# Altium schematic sheet LCD_screen.SchDoc
size A; SheetNumber: 9; SheetTotal: 10
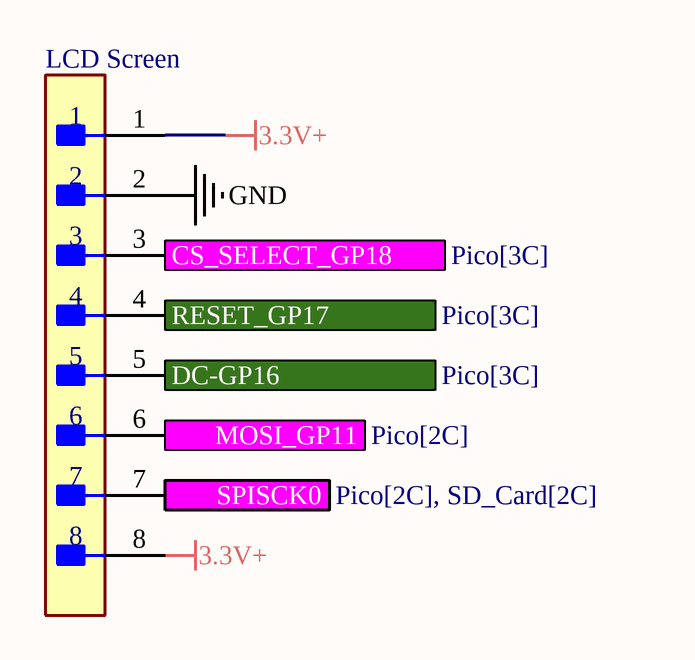
[diagram p0: LCD_screen.SchDoc]

## Parts
LCD_Screen  LCD  [FP-TSW-108-08-G-S-MFG]  (value not drawn)

## Ports
CS_SELECT_GP18 (in, see Pico[3C]), DC-GP16 (in, see Pico[3C]), MOSI_GP11 (in, see Pico[2C]), RESET_GP17 (in, see Pico[3C]), SPISCK0 (in, see Pico[2C], SD_Card[2C])

## Nets
3.3V+: LCD_Screen.1 LCD_Screen.8
GND: LCD_Screen.2
CS_SELECT_GP18: LCD_Screen.3 ; port CS_SELECT_GP18
DC-GP16: LCD_Screen.5 ; port DC-GP16
MOSI_GP11: LCD_Screen.6 ; port MOSI_GP11
RESET_GP17: LCD_Screen.4 ; port RESET_GP17
SPISCK0: LCD_Screen.7 ; port SPISCK0

## Library data of the parts
LCD_Screen = CMP-02766-000001-1: CONN HEADER VERT 8POS 2.54MM; Manufacturer Part Number: TSW-108-08-G-S; Manufacturer: Samtec; Number Of Contacts: 8; Conn Orientation: Straight; Conn Gender: Male; Device Class L1: Connectors; ComponentLink2Description: Datasheet; Digikey Description: CONN HEADER VERT 8POS 2.54MM; ComponentLink2URL: http://suddendocs.samtec.com/catalog_english/tsw_th.pdf; Temperature: -55°C to +125°C; RoHS: TRUE; Mouser Description: TSW - Samtec 2.54mm Pin Header 13.46mm Overall Pin Length 5.08mm Tail; Automotive: No; Temperature Range High: +125°C; Package: TSW-108-08-G-S; Device Class L3: unset; Pitch: 2.54mm; Number Of Rows: 1; Lead Free: Yes; Height: 8.71mm; Contact Material: Gold,Nickel; Footprint Url: http://suddendocs.samtec.com/prints/tsw-xxx-xx-x-x-xx-xxx-footprint.pdf; Temperature Range Low: -55°C; Octopart: https://octopart.com/tsw-108-08-g-s-samtec-272653; Category: Conn; Device Class L2: Headers and Wire Housings